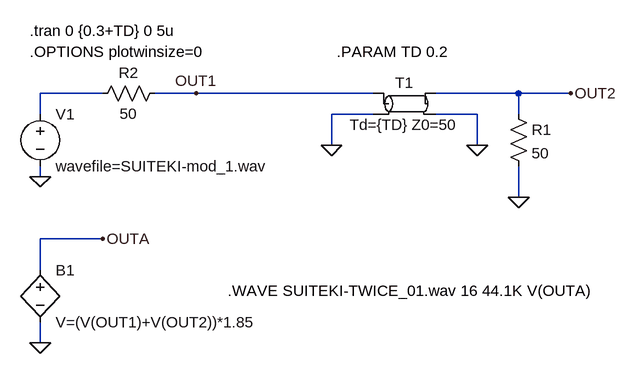
[diagram p0: schematic Fig_2-142_SUITEKI-2.asc]
Fig_2-142_SUITEKI-2.asc, the LTspice schematic file:
Version 4
SHEET 1 1796 772
WIRE -208 112 -304 112
WIRE -64 112 -128 112
WIRE 208 112 -64 112
WIRE 432 112 304 112
WIRE 512 112 432 112
WIRE -304 144 -304 112
WIRE 208 144 144 144
WIRE 368 144 304 144
WIRE 432 144 432 112
WIRE 144 192 144 144
WIRE 368 192 368 144
WIRE -304 240 -304 224
WIRE 432 272 432 224
WIRE -208 336 -304 336
WIRE -304 384 -304 336
WIRE -304 496 -304 464
FLAG -304 240 0
FLAG -64 112 OUT1
FLAG 512 112 OUT2
FLAG 368 192 0
FLAG 144 192 0
FLAG 432 272 0
FLAG -304 496 0
FLAG -208 336 OUTA
SYMBOL voltage -304 128 R0
SYMATTR InstName V1
SYMATTR Value wavefile=SUITEKI-mod_1.wav
SYMBOL tline 256 128 R0
SYMATTR InstName T1
SYMATTR Value Td={TD} Z0=50
SYMBOL res 416 128 R0
SYMATTR InstName R1
SYMATTR Value 50
SYMBOL res -224 128 R270
WINDOW 0 32 56 VTop 2
WINDOW 3 0 56 VBottom 2
SYMATTR InstName R2
SYMATTR Value 50
SYMBOL bv -304 368 R0
SYMATTR InstName B1
SYMATTR Value V=(V(OUT1)+V(OUT2))*1.85
TEXT -16 416 Left 2 !.WAVE SUITEKI-TWICE_01.wav 16 44.1K V(OUTA)
TEXT -320 16 Left 2 !.tran 0 {0.3+TD} 0 5u
TEXT 152 48 Left 2 !.PARAM TD 0.2
TEXT -320 48 Left 2 !.OPTIONS plotwinsize=0

The netlist it stands for:
* Fig_2-142_SUITEKI-2.asc
V1 N001 0 wavefile=SUITEKI-mod_1.wav
T1 OUT1 0 OUT2 0 Td={TD} Z0=50
R1 OUT2 0 50
R2 N001 OUT1 50
B1 OUTA 0 V=(V(OUT1)+V(OUT2))*1.85
.WAVE SUITEKI-TWICE_01.wav 16 44.1K V(OUTA)
.tran 0 {0.3+TD} 0 5u
.PARAM TD 0.2
.OPTIONS plotwinsize=0
.backanno
.end